# Altium schematic sheet Async.SchDoc
size B
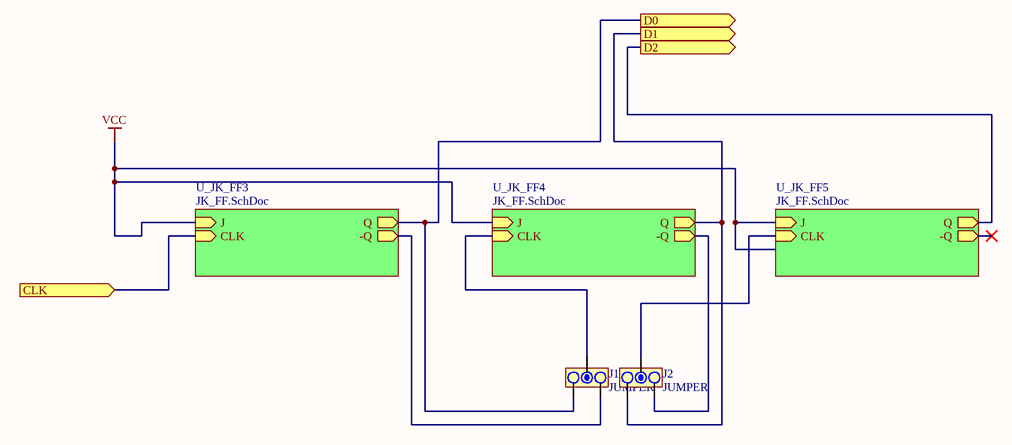
[diagram p0: Async.SchDoc]

## Parts
J1  JUMPER  [JUMPER3]
J2  JUMPER  [JUMPER3]

## Sub-sheets
U_JK_FF3 = JK_FF.SchDoc: J (in), CLK (in), Q (out), -Q (out)
U_JK_FF4 = JK_FF.SchDoc: J (in), CLK (in), Q (out), -Q (out)
U_JK_FF5 = JK_FF.SchDoc: J (in), CLK (in), Q (out), -Q (out)

## Ports
CLK (in), D0 (out), D1 (out), D2 (out)

## Nets
VCC: sheet U_JK_FF3/J, sheet U_JK_FF4/J, sheet U_JK_FF5/J
CLK: port CLK, sheet U_JK_FF3/CLK
D0: J1.3 ; port D0, sheet U_JK_FF3/Q
D1: J2.3 ; port D1, sheet U_JK_FF4/Q
D2: port D2, sheet U_JK_FF5/Q
NetJ1_1: J1.1 ; sheet U_JK_FF3/-Q
NetJ1_2: J1.2 ; sheet U_JK_FF4/CLK
NetJ2_1: J2.1 ; sheet U_JK_FF4/-Q
NetJ2_2: J2.2 ; sheet U_JK_FF5/CLK

## Library data of the parts
J1 J2 = JUMPER3